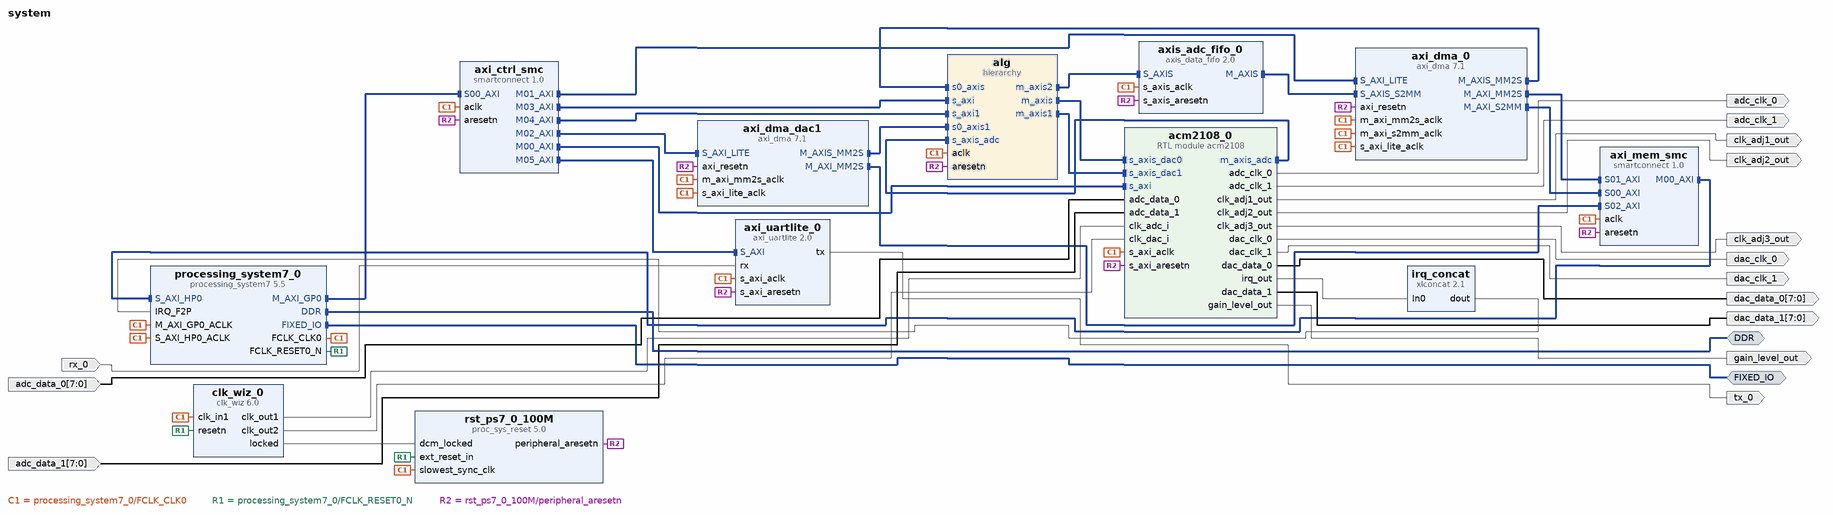
[diagram p0: block diagram of the top level]
# Vivado block design system, xc7z020clg400-1, Vivado 2025.1
create_bd_design system

create_bd_intf_port -mode Master -vlnv xilinx.com:interface:ddrx_rtl:1.0 DDR
create_bd_intf_port -mode Master -vlnv xilinx.com:display_processing_system7:fixedio_rtl:1.0 FIXED_IO
create_bd_port -dir O adc_clk_0
create_bd_port -dir I -from 7 -to 0 adc_data_0
create_bd_port -dir O adc_clk_1
create_bd_port -dir I -from 7 -to 0 adc_data_1
create_bd_port -dir O dac_clk_0
create_bd_port -dir O -from 7 -to 0 dac_data_0
create_bd_port -dir O dac_clk_1
create_bd_port -dir O -from 7 -to 0 dac_data_1
create_bd_port -dir O clk_adj1_out
create_bd_port -dir O clk_adj2_out
create_bd_port -dir O clk_adj3_out
create_bd_port -dir I rx_0
create_bd_port -dir O tx_0
create_bd_port -dir O gain_level_out

create_bd_cell -type ip -vlnv xilinx.com:ip:processing_system7:5.5 processing_system7_0
set_property -dict [list \
  CONFIG.PCW_APU_PERIPHERAL_FREQMHZ 666.666666 \
  CONFIG.PCW_ENET0_PERIPHERAL_ENABLE 0 \
  CONFIG.PCW_FPGA0_PERIPHERAL_FREQMHZ 50 \
  CONFIG.PCW_FPGA1_PERIPHERAL_FREQMHZ 50 \
  CONFIG.PCW_GPIO_MIO_GPIO_ENABLE 0 \
  CONFIG.PCW_IRQ_F2P_INTR 1 \
  CONFIG.PCW_PERIPHERAL_BOARD_PRESET None \
  CONFIG.PCW_PRESET_BANK1_VOLTAGE {LVCMOS 3.3V} \
  CONFIG.PCW_QSPI_PERIPHERAL_ENABLE 0 \
  CONFIG.PCW_SD0_GRP_CD_ENABLE 0 \
  CONFIG.PCW_SD0_GRP_WP_ENABLE 0 \
  CONFIG.PCW_SD0_PERIPHERAL_ENABLE 1 \
  CONFIG.PCW_SD0_SD0_IO {MIO 40 .. 45} \
  CONFIG.PCW_SDIO_PERIPHERAL_FREQMHZ 100 \
  CONFIG.PCW_UART1_PERIPHERAL_ENABLE 1 \
  CONFIG.PCW_UART1_UART1_IO {MIO 48 .. 49} \
  CONFIG.PCW_UART_PERIPHERAL_FREQMHZ 100 \
  CONFIG.PCW_UIPARAM_DDR_BUS_WIDTH {16 Bit} \
  CONFIG.PCW_UIPARAM_DDR_FREQ_MHZ 533.333333 \
  CONFIG.PCW_UIPARAM_DDR_PARTNO {MT41K256M16 RE-125} \
  CONFIG.PCW_USB0_PERIPHERAL_ENABLE 0 \
  CONFIG.PCW_USE_FABRIC_INTERRUPT 1 \
  CONFIG.PCW_USE_S_AXI_HP0 1 \
  CONFIG.preset None \
] [get_bd_cells processing_system7_0]
# 367 more settings of processing_system7_0 are not shown: defaults, MIO pin electricals, DDR timing, and values the tool derives
create_bd_cell -type ip -vlnv xilinx.com:ip:clk_wiz:6.0 clk_wiz_0
set_property -dict [list \
  CONFIG.CLKOUT1_REQUESTED_OUT_FREQ 35.000 \
  CONFIG.CLKOUT2_REQUESTED_OUT_FREQ 125.000 \
  CONFIG.CLKOUT2_USED true \
  CONFIG.NUM_OUT_CLKS 2 \
  CONFIG.PRIM_IN_FREQ 50.000 \
  CONFIG.PRIM_SOURCE No_buffer \
  CONFIG.RESET_TYPE ACTIVE_LOW \
  CONFIG.USE_RESET true \
] [get_bd_cells clk_wiz_0]
create_bd_cell -type ip -vlnv xilinx.com:ip:proc_sys_reset:5.0 rst_ps7_0_100M
create_bd_cell -type ip -vlnv xilinx.com:ip:smartconnect:1.0 axi_ctrl_smc
set_property -dict {CONFIG.NUM_CLKS 1 CONFIG.NUM_MI 6 CONFIG.NUM_SI 1} [get_bd_cells axi_ctrl_smc]
create_bd_cell -type ip -vlnv xilinx.com:ip:smartconnect:1.0 axi_mem_smc
set_property -dict {CONFIG.NUM_MI 1 CONFIG.NUM_SI 3} [get_bd_cells axi_mem_smc]
create_bd_cell -type ip -vlnv xilinx.com:ip:axi_dma:7.1 axi_dma_0
set_property -dict [list \
  CONFIG.c_include_mm2s 1 \
  CONFIG.c_include_s2mm 1 \
  CONFIG.c_include_sg 0 \
  CONFIG.c_s2mm_burst_size 16 \
  CONFIG.c_sg_length_width 23 \
] [get_bd_cells axi_dma_0]
create_bd_cell -type ip -vlnv xilinx.com:ip:axis_data_fifo:2.0 axis_adc_fifo_0
set_property -dict {CONFIG.FIFO_DEPTH 1024 CONFIG.HAS_TLAST 1 CONFIG.TDATA_NUM_BYTES 4} [get_bd_cells axis_adc_fifo_0]
create_bd_cell -type module -reference acm2108 acm2108_0
create_bd_cell -type ip -vlnv xilinx.com:ip:axi_dma:7.1 axi_dma_dac1
set_property -dict [list \
  CONFIG.c_include_mm2s 1 \
  CONFIG.c_include_s2mm 0 \
  CONFIG.c_include_sg 0 \
  CONFIG.c_mm2s_burst_size 16 \
  CONFIG.c_sg_length_width 23 \
] [get_bd_cells axi_dma_dac1]
create_bd_cell -type ip -vlnv xilinx.com:ip:xlconcat:2.1 irq_concat
set_property -dict {CONFIG.IN0_WIDTH 1 CONFIG.NUM_PORTS 1} [get_bd_cells irq_concat]
create_bd_cell -type hier alg
create_bd_cell -type ip -vlnv xilinx.com:ip:axi_uartlite:2.0 axi_uartlite_0
set_property -dict [list \
  CONFIG.C_BAUDRATE 115200 \
  CONFIG.C_DATA_BITS 8 \
  CONFIG.C_ODD_PARITY 0 \
  CONFIG.C_USE_PARITY 0 \
] [get_bd_cells axi_uartlite_0]

# ---- hierarchy /alg ----
current_bd_instance /alg
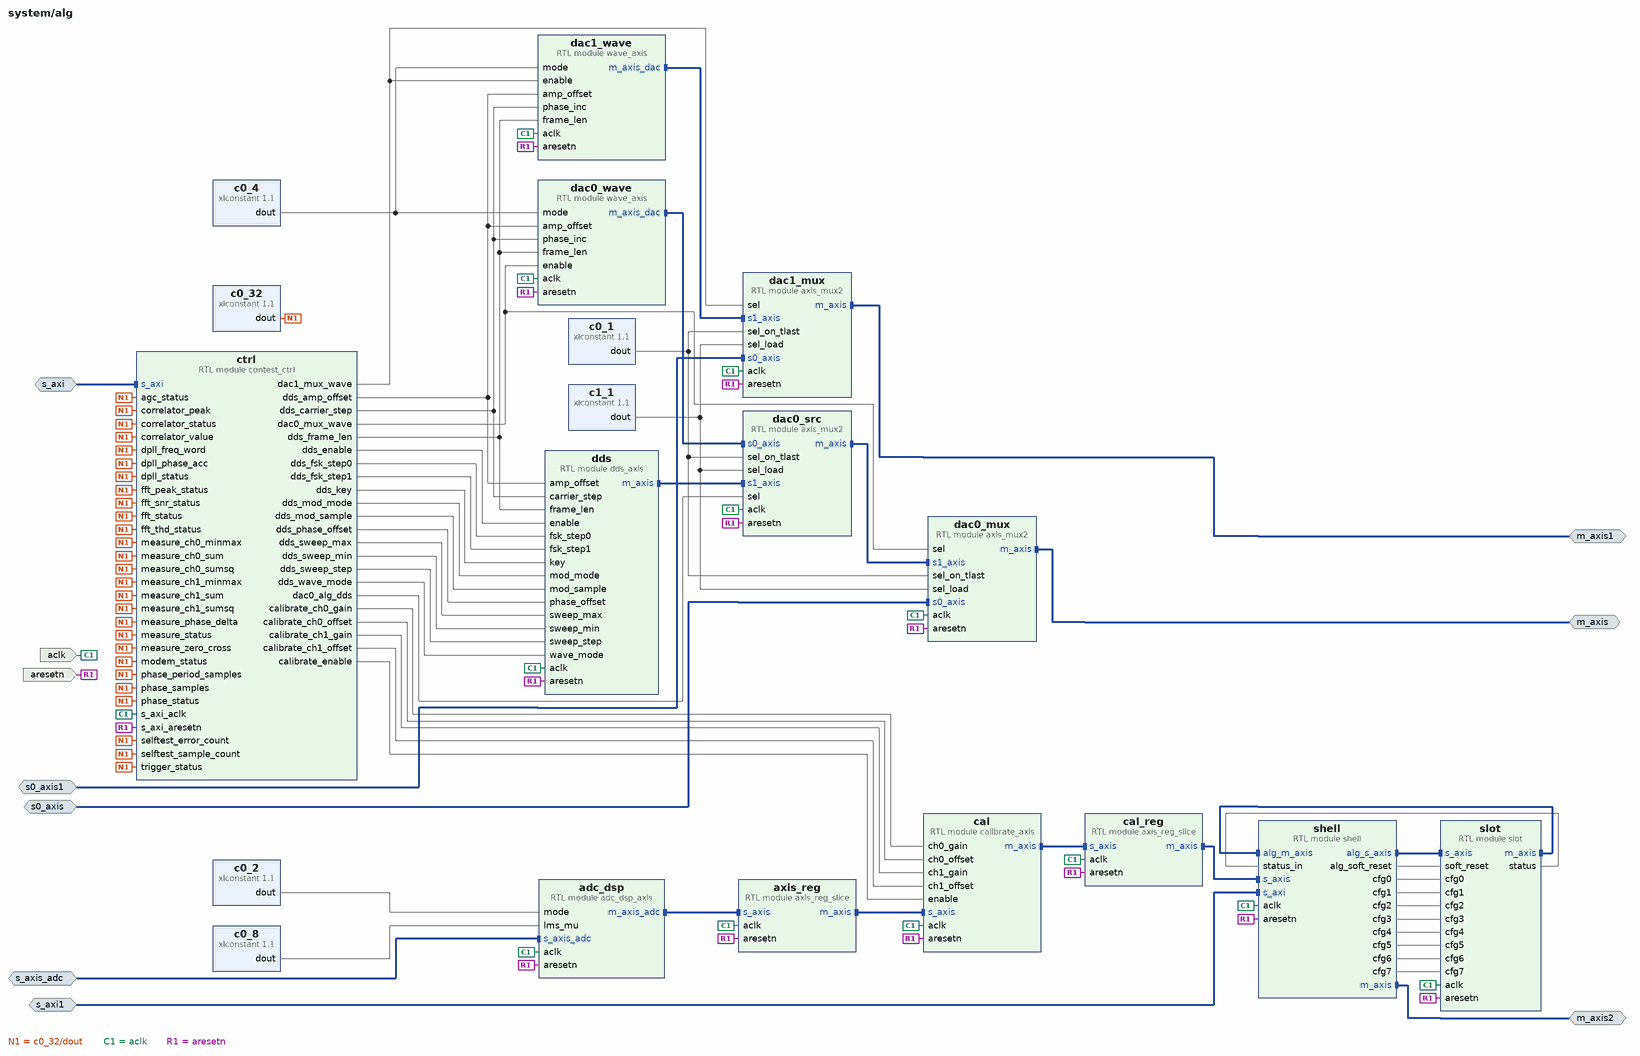
[diagram p1: block diagram inside /alg]
create_bd_intf_pin -mode Slave -vlnv xilinx.com:interface:aximm_rtl:1.0 s_axi
create_bd_intf_pin -mode Slave -vlnv xilinx.com:interface:axis_rtl:1.0 s_axis_adc
create_bd_intf_pin -mode Slave -vlnv xilinx.com:interface:axis_rtl:1.0 s0_axis
create_bd_intf_pin -mode Master -vlnv xilinx.com:interface:axis_rtl:1.0 m_axis
create_bd_intf_pin -mode Slave -vlnv xilinx.com:interface:axis_rtl:1.0 s0_axis1
create_bd_intf_pin -mode Master -vlnv xilinx.com:interface:axis_rtl:1.0 m_axis1
create_bd_intf_pin -mode Master -vlnv xilinx.com:interface:axis_rtl:1.0 m_axis2
create_bd_intf_pin -mode Slave -vlnv xilinx.com:interface:aximm_rtl:1.0 s_axi1
create_bd_pin -dir I -type clk aclk
create_bd_pin -dir I -type rst aresetn

create_bd_cell -type module -reference contest_ctrl ctrl
create_bd_cell -type module -reference adc_dsp_axis adc_dsp
create_bd_cell -type module -reference wave_axis dac0_wave
create_bd_cell -type module -reference wave_axis dac1_wave
create_bd_cell -type module -reference axis_mux2 dac0_mux
create_bd_cell -type module -reference axis_mux2 dac1_mux
create_bd_cell -type module -reference shell shell
create_bd_cell -type module -reference axis_reg_slice axis_reg
create_bd_cell -type module -reference axis_reg_slice cal_reg
create_bd_cell -type module -reference axis_mux2 dac0_src
create_bd_cell -type module -reference dds_axis dds
create_bd_cell -type module -reference calibrate_axis cal
create_bd_cell -type ip -vlnv xilinx.com:ip:xlconstant:1.1 c0_1
set_property -dict {CONFIG.CONST_VAL 0 CONFIG.CONST_WIDTH 1} [get_bd_cells c0_1]
create_bd_cell -type ip -vlnv xilinx.com:ip:xlconstant:1.1 c1_1
set_property -dict {CONFIG.CONST_VAL 1 CONFIG.CONST_WIDTH 1} [get_bd_cells c1_1]
create_bd_cell -type ip -vlnv xilinx.com:ip:xlconstant:1.1 c0_2
set_property -dict {CONFIG.CONST_VAL 0 CONFIG.CONST_WIDTH 2} [get_bd_cells c0_2]
create_bd_cell -type ip -vlnv xilinx.com:ip:xlconstant:1.1 c0_4
set_property -dict {CONFIG.CONST_VAL 0 CONFIG.CONST_WIDTH 4} [get_bd_cells c0_4]
create_bd_cell -type ip -vlnv xilinx.com:ip:xlconstant:1.1 c0_8
set_property -dict {CONFIG.CONST_VAL 0 CONFIG.CONST_WIDTH 8} [get_bd_cells c0_8]
create_bd_cell -type ip -vlnv xilinx.com:ip:xlconstant:1.1 c0_32
set_property -dict {CONFIG.CONST_VAL 0 CONFIG.CONST_WIDTH 32} [get_bd_cells c0_32]
create_bd_cell -type module -reference slot slot

# ---- connections ----

current_bd_instance /alg
connect_bd_intf_net -intf_net acm2108_0_m_axis_adc [get_bd_intf_pins s_axis_adc] [get_bd_intf_pins adc_dsp/s_axis_adc]
connect_bd_intf_net [get_bd_intf_pins adc_dsp/m_axis_adc] [get_bd_intf_pins axis_reg/s_axis]
connect_bd_intf_net -intf_net axi_ctrl_smc_M03_AXI [get_bd_intf_pins s_axi] [get_bd_intf_pins ctrl/s_axi]
connect_bd_intf_net -intf_net axi_ctrl_smc_M04_AXI [get_bd_intf_pins s_axi1] [get_bd_intf_pins shell/s_axi]
connect_bd_intf_net -intf_net axi_dma_0_M_AXIS_MM2S [get_bd_intf_pins s0_axis] [get_bd_intf_pins dac0_mux/s0_axis]
connect_bd_intf_net -intf_net axi_dma_dac1_M_AXIS_MM2S [get_bd_intf_pins s0_axis1] [get_bd_intf_pins dac1_mux/s0_axis]
connect_bd_intf_net [get_bd_intf_pins axis_reg/m_axis] [get_bd_intf_pins cal/s_axis]
connect_bd_intf_net [get_bd_intf_pins cal/m_axis] [get_bd_intf_pins cal_reg/s_axis]
connect_bd_intf_net [get_bd_intf_pins cal_reg/m_axis] [get_bd_intf_pins shell/s_axis]
connect_bd_intf_net [get_bd_intf_pins m_axis] [get_bd_intf_pins dac0_mux/m_axis]
connect_bd_intf_net [get_bd_intf_pins dac0_src/m_axis] [get_bd_intf_pins dac0_mux/s1_axis]
connect_bd_intf_net [get_bd_intf_pins dac0_wave/m_axis_dac] [get_bd_intf_pins dac0_src/s0_axis]
connect_bd_intf_net [get_bd_intf_pins m_axis1] [get_bd_intf_pins dac1_mux/m_axis]
connect_bd_intf_net [get_bd_intf_pins dac1_wave/m_axis_dac] [get_bd_intf_pins dac1_mux/s1_axis]
connect_bd_intf_net [get_bd_intf_pins dds/m_axis] [get_bd_intf_pins dac0_src/s1_axis]
connect_bd_intf_net [get_bd_intf_pins shell/alg_s_axis] [get_bd_intf_pins slot/s_axis]
connect_bd_intf_net [get_bd_intf_pins m_axis2] [get_bd_intf_pins shell/m_axis]
connect_bd_intf_net [get_bd_intf_pins slot/m_axis] [get_bd_intf_pins shell/alg_m_axis]
connect_bd_net [get_bd_pins c0_1/dout] [get_bd_pins dac0_mux/sel_on_tlast] [get_bd_pins dac1_mux/sel_on_tlast] [get_bd_pins dac0_src/sel_on_tlast]
connect_bd_net [get_bd_pins c0_2/dout] [get_bd_pins adc_dsp/mode]
connect_bd_net [get_bd_pins c0_32/dout] \
  [get_bd_pins ctrl/fft_status] [get_bd_pins ctrl/fft_peak_status] [get_bd_pins ctrl/fft_thd_status] \
  [get_bd_pins ctrl/fft_snr_status] [get_bd_pins ctrl/measure_status] [get_bd_pins ctrl/measure_ch0_minmax] \
  [get_bd_pins ctrl/measure_ch1_minmax] [get_bd_pins ctrl/measure_ch0_sum] [get_bd_pins ctrl/measure_ch1_sum] \
  [get_bd_pins ctrl/measure_ch0_sumsq] [get_bd_pins ctrl/measure_ch1_sumsq] [get_bd_pins ctrl/measure_zero_cross] \
  [get_bd_pins ctrl/measure_phase_delta] [get_bd_pins ctrl/trigger_status] [get_bd_pins ctrl/agc_status] \
  [get_bd_pins ctrl/phase_samples] [get_bd_pins ctrl/phase_period_samples] [get_bd_pins ctrl/phase_status] \
  [get_bd_pins ctrl/correlator_value] [get_bd_pins ctrl/correlator_peak] [get_bd_pins ctrl/correlator_status] \
  [get_bd_pins ctrl/dpll_phase_acc] [get_bd_pins ctrl/dpll_freq_word] [get_bd_pins ctrl/dpll_status] \
  [get_bd_pins ctrl/selftest_error_count] [get_bd_pins ctrl/selftest_sample_count] [get_bd_pins ctrl/modem_status]
connect_bd_net [get_bd_pins c0_4/dout] [get_bd_pins dac0_wave/mode] [get_bd_pins dac1_wave/mode]
connect_bd_net [get_bd_pins c0_8/dout] [get_bd_pins adc_dsp/lms_mu]
connect_bd_net [get_bd_pins c1_1/dout] [get_bd_pins dac0_mux/sel_load] [get_bd_pins dac1_mux/sel_load] [get_bd_pins dac0_src/sel_load]
connect_bd_net [get_bd_pins ctrl/calibrate_ch0_gain] [get_bd_pins cal/ch0_gain]
connect_bd_net [get_bd_pins ctrl/calibrate_ch0_offset] [get_bd_pins cal/ch0_offset]
connect_bd_net [get_bd_pins ctrl/calibrate_ch1_gain] [get_bd_pins cal/ch1_gain]
connect_bd_net [get_bd_pins ctrl/calibrate_ch1_offset] [get_bd_pins cal/ch1_offset]
connect_bd_net [get_bd_pins ctrl/calibrate_enable] [get_bd_pins cal/enable]
connect_bd_net [get_bd_pins ctrl/dac0_alg_dds] [get_bd_pins dac0_src/sel]
connect_bd_net [get_bd_pins ctrl/dac0_mux_wave] [get_bd_pins dac0_mux/sel] [get_bd_pins dac0_wave/enable]
connect_bd_net [get_bd_pins ctrl/dac1_mux_wave] [get_bd_pins dac1_mux/sel] [get_bd_pins dac1_wave/enable]
connect_bd_net [get_bd_pins ctrl/dds_amp_offset] [get_bd_pins dds/amp_offset] [get_bd_pins dac0_wave/amp_offset] [get_bd_pins dac1_wave/amp_offset]
connect_bd_net [get_bd_pins ctrl/dds_carrier_step] [get_bd_pins dds/carrier_step] [get_bd_pins dac0_wave/phase_inc] [get_bd_pins dac1_wave/phase_inc]
connect_bd_net [get_bd_pins ctrl/dds_enable] [get_bd_pins dds/enable]
connect_bd_net [get_bd_pins ctrl/dds_frame_len] [get_bd_pins dds/frame_len] [get_bd_pins dac0_wave/frame_len] [get_bd_pins dac1_wave/frame_len]
connect_bd_net [get_bd_pins ctrl/dds_fsk_step0] [get_bd_pins dds/fsk_step0]
connect_bd_net [get_bd_pins ctrl/dds_fsk_step1] [get_bd_pins dds/fsk_step1]
connect_bd_net [get_bd_pins ctrl/dds_key] [get_bd_pins dds/key]
connect_bd_net [get_bd_pins ctrl/dds_mod_mode] [get_bd_pins dds/mod_mode]
connect_bd_net [get_bd_pins ctrl/dds_mod_sample] [get_bd_pins dds/mod_sample]
connect_bd_net [get_bd_pins ctrl/dds_phase_offset] [get_bd_pins dds/phase_offset]
connect_bd_net [get_bd_pins ctrl/dds_sweep_max] [get_bd_pins dds/sweep_max]
connect_bd_net [get_bd_pins ctrl/dds_sweep_min] [get_bd_pins dds/sweep_min]
connect_bd_net [get_bd_pins ctrl/dds_sweep_step] [get_bd_pins dds/sweep_step]
connect_bd_net [get_bd_pins ctrl/dds_wave_mode] [get_bd_pins dds/wave_mode]
connect_bd_net -net processing_system7_0_FCLK_CLK0 [get_bd_pins aclk] \
  [get_bd_pins adc_dsp/aclk] [get_bd_pins dac0_mux/aclk] [get_bd_pins dac1_mux/aclk] [get_bd_pins shell/aclk] \
  [get_bd_pins axis_reg/aclk] [get_bd_pins cal_reg/aclk] [get_bd_pins dac0_src/aclk] [get_bd_pins dds/aclk] \
  [get_bd_pins cal/aclk] [get_bd_pins ctrl/s_axi_aclk] [get_bd_pins dac0_wave/aclk] [get_bd_pins dac1_wave/aclk] \
  [get_bd_pins slot/aclk]
connect_bd_net -net rst_ps7_0_100M_peripheral_aresetn [get_bd_pins aresetn] \
  [get_bd_pins adc_dsp/aresetn] [get_bd_pins dac0_mux/aresetn] [get_bd_pins dac1_mux/aresetn] [get_bd_pins shell/aresetn] \
  [get_bd_pins axis_reg/aresetn] [get_bd_pins cal_reg/aresetn] [get_bd_pins dac0_src/aresetn] [get_bd_pins dds/aresetn] \
  [get_bd_pins cal/aresetn] [get_bd_pins ctrl/s_axi_aresetn] [get_bd_pins dac0_wave/aresetn] [get_bd_pins dac1_wave/aresetn] \
  [get_bd_pins slot/aresetn]
connect_bd_net [get_bd_pins shell/alg_soft_reset] [get_bd_pins slot/soft_reset]
connect_bd_net [get_bd_pins shell/cfg0] [get_bd_pins slot/cfg0]
connect_bd_net [get_bd_pins shell/cfg1] [get_bd_pins slot/cfg1]
connect_bd_net [get_bd_pins shell/cfg2] [get_bd_pins slot/cfg2]
connect_bd_net [get_bd_pins shell/cfg3] [get_bd_pins slot/cfg3]
connect_bd_net [get_bd_pins shell/cfg4] [get_bd_pins slot/cfg4]
connect_bd_net [get_bd_pins shell/cfg5] [get_bd_pins slot/cfg5]
connect_bd_net [get_bd_pins shell/cfg6] [get_bd_pins slot/cfg6]
connect_bd_net [get_bd_pins shell/cfg7] [get_bd_pins slot/cfg7]
connect_bd_net [get_bd_pins slot/status] [get_bd_pins shell/status_in]

current_bd_instance /
connect_bd_intf_net [get_bd_intf_pins acm2108_0/m_axis_adc] [get_bd_intf_pins alg/s_axis_adc]
connect_bd_intf_net [get_bd_intf_pins axi_ctrl_smc/M00_AXI] [get_bd_intf_pins acm2108_0/s_axi]
connect_bd_intf_net [get_bd_intf_pins axi_ctrl_smc/M01_AXI] [get_bd_intf_pins axi_dma_0/S_AXI_LITE]
connect_bd_intf_net [get_bd_intf_pins axi_ctrl_smc/M02_AXI] [get_bd_intf_pins axi_dma_dac1/S_AXI_LITE]
connect_bd_intf_net [get_bd_intf_pins axi_ctrl_smc/M03_AXI] [get_bd_intf_pins alg/s_axi]
connect_bd_intf_net [get_bd_intf_pins axi_ctrl_smc/M04_AXI] [get_bd_intf_pins alg/s_axi1]
connect_bd_intf_net [get_bd_intf_pins axi_ctrl_smc/M05_AXI] [get_bd_intf_pins axi_uartlite_0/S_AXI]
connect_bd_intf_net [get_bd_intf_pins axi_dma_0/M_AXIS_MM2S] [get_bd_intf_pins alg/s0_axis]
connect_bd_intf_net [get_bd_intf_pins axi_dma_0/M_AXI_MM2S] [get_bd_intf_pins axi_mem_smc/S01_AXI]
connect_bd_intf_net [get_bd_intf_pins axi_dma_0/M_AXI_S2MM] [get_bd_intf_pins axi_mem_smc/S00_AXI]
connect_bd_intf_net [get_bd_intf_pins axi_dma_dac1/M_AXIS_MM2S] [get_bd_intf_pins alg/s0_axis1]
connect_bd_intf_net [get_bd_intf_pins axi_dma_dac1/M_AXI_MM2S] [get_bd_intf_pins axi_mem_smc/S02_AXI]
connect_bd_intf_net [get_bd_intf_pins axi_mem_smc/M00_AXI] [get_bd_intf_pins processing_system7_0/S_AXI_HP0]
connect_bd_intf_net [get_bd_intf_pins axis_adc_fifo_0/M_AXIS] [get_bd_intf_pins axi_dma_0/S_AXIS_S2MM]
connect_bd_intf_net -intf_net dac0_mux_m_axis [get_bd_intf_pins alg/m_axis] [get_bd_intf_pins acm2108_0/s_axis_dac0]
connect_bd_intf_net -intf_net dac1_mux_m_axis [get_bd_intf_pins alg/m_axis1] [get_bd_intf_pins acm2108_0/s_axis_dac1]
connect_bd_intf_net [get_bd_intf_ports DDR] [get_bd_intf_pins processing_system7_0/DDR]
connect_bd_intf_net [get_bd_intf_ports FIXED_IO] [get_bd_intf_pins processing_system7_0/FIXED_IO]
connect_bd_intf_net [get_bd_intf_pins processing_system7_0/M_AXI_GP0] [get_bd_intf_pins axi_ctrl_smc/S00_AXI]
connect_bd_intf_net -intf_net shell_m_axis [get_bd_intf_pins alg/m_axis2] [get_bd_intf_pins axis_adc_fifo_0/S_AXIS]
connect_bd_net [get_bd_pins acm2108_0/adc_clk_0] [get_bd_ports adc_clk_0]
connect_bd_net [get_bd_pins acm2108_0/adc_clk_1] [get_bd_ports adc_clk_1]
connect_bd_net [get_bd_pins acm2108_0/clk_adj1_out] [get_bd_ports clk_adj1_out]
connect_bd_net [get_bd_pins acm2108_0/clk_adj2_out] [get_bd_ports clk_adj2_out]
connect_bd_net [get_bd_pins acm2108_0/clk_adj3_out] [get_bd_ports clk_adj3_out]
connect_bd_net [get_bd_pins acm2108_0/dac_clk_0] [get_bd_ports dac_clk_0]
connect_bd_net [get_bd_pins acm2108_0/dac_clk_1] [get_bd_ports dac_clk_1]
connect_bd_net [get_bd_pins acm2108_0/dac_data_0] [get_bd_ports dac_data_0]
connect_bd_net [get_bd_pins acm2108_0/dac_data_1] [get_bd_ports dac_data_1]
connect_bd_net [get_bd_pins acm2108_0/gain_level_out] [get_bd_ports gain_level_out]
connect_bd_net [get_bd_pins acm2108_0/irq_out] [get_bd_pins irq_concat/In0]
connect_bd_net -net adc_data_0_0_1 [get_bd_ports adc_data_0] [get_bd_pins acm2108_0/adc_data_0]
connect_bd_net -net adc_data_1_0_1 [get_bd_ports adc_data_1] [get_bd_pins acm2108_0/adc_data_1]
connect_bd_net [get_bd_pins axi_uartlite_0/tx] [get_bd_ports tx_0]
connect_bd_net [get_bd_pins clk_wiz_0/clk_out1] [get_bd_pins acm2108_0/clk_adc_i]
connect_bd_net [get_bd_pins clk_wiz_0/clk_out2] [get_bd_pins acm2108_0/clk_dac_i]
connect_bd_net [get_bd_pins clk_wiz_0/locked] [get_bd_pins rst_ps7_0_100M/dcm_locked]
connect_bd_net [get_bd_pins irq_concat/dout] [get_bd_pins processing_system7_0/IRQ_F2P]
connect_bd_net [get_bd_pins processing_system7_0/FCLK_CLK0] \
  [get_bd_pins processing_system7_0/M_AXI_GP0_ACLK] [get_bd_pins processing_system7_0/S_AXI_HP0_ACLK] \
  [get_bd_pins clk_wiz_0/clk_in1] [get_bd_pins rst_ps7_0_100M/slowest_sync_clk] [get_bd_pins axi_ctrl_smc/aclk] \
  [get_bd_pins axi_mem_smc/aclk] [get_bd_pins axi_dma_0/s_axi_lite_aclk] [get_bd_pins axi_dma_0/m_axi_mm2s_aclk] \
  [get_bd_pins axi_dma_0/m_axi_s2mm_aclk] [get_bd_pins axis_adc_fifo_0/s_axis_aclk] \
  [get_bd_pins axi_dma_dac1/s_axi_lite_aclk] [get_bd_pins axi_dma_dac1/m_axi_mm2s_aclk] [get_bd_pins alg/aclk] \
  [get_bd_pins axi_uartlite_0/s_axi_aclk] [get_bd_pins acm2108_0/s_axi_aclk]
connect_bd_net [get_bd_pins processing_system7_0/FCLK_RESET0_N] [get_bd_pins clk_wiz_0/resetn] [get_bd_pins rst_ps7_0_100M/ext_reset_in]
connect_bd_net [get_bd_pins rst_ps7_0_100M/peripheral_aresetn] \
  [get_bd_pins axi_ctrl_smc/aresetn] [get_bd_pins axi_mem_smc/aresetn] [get_bd_pins axi_dma_0/axi_resetn] \
  [get_bd_pins axis_adc_fifo_0/s_axis_aresetn] [get_bd_pins axi_dma_dac1/axi_resetn] [get_bd_pins alg/aresetn] \
  [get_bd_pins axi_uartlite_0/s_axi_aresetn] [get_bd_pins acm2108_0/s_axi_aresetn]
connect_bd_net -net rx_0_1 [get_bd_ports rx_0] [get_bd_pins axi_uartlite_0/rx]

# ---- address map ----
assign_bd_address -offset 0x00000000 -range 512M -target_address_space [get_bd_addr_spaces axi_dma_0/Data_MM2S] [get_bd_addr_segs processing_system7_0/S_AXI_HP0/HP0_DDR_LOWOCM]
assign_bd_address -offset 0x00000000 -range 512M -target_address_space [get_bd_addr_spaces axi_dma_0/Data_S2MM] [get_bd_addr_segs processing_system7_0/S_AXI_HP0/HP0_DDR_LOWOCM]
assign_bd_address -offset 0x00000000 -range 512M -target_address_space [get_bd_addr_spaces axi_dma_dac1/Data_MM2S] [get_bd_addr_segs processing_system7_0/S_AXI_HP0/HP0_DDR_LOWOCM]
assign_bd_address -offset 0x40000000 -range 64K -target_address_space [get_bd_addr_spaces processing_system7_0/Data] [get_bd_addr_segs acm2108_0/s_axi/reg0]
assign_bd_address -offset 0x40010000 -range 64K -target_address_space [get_bd_addr_spaces processing_system7_0/Data] [get_bd_addr_segs alg/ctrl/s_axi/reg0]
assign_bd_address -offset 0x40030000 -range 64K -target_address_space [get_bd_addr_spaces processing_system7_0/Data] [get_bd_addr_segs alg/shell/s_axi/reg0]
assign_bd_address -offset 0x40400000 -range 64K -target_address_space [get_bd_addr_spaces processing_system7_0/Data] [get_bd_addr_segs axi_dma_0/S_AXI_LITE/Reg]
assign_bd_address -offset 0x40410000 -range 64K -target_address_space [get_bd_addr_spaces processing_system7_0/Data] [get_bd_addr_segs axi_dma_dac1/S_AXI_LITE/Reg]
assign_bd_address -offset 0x42C00000 -range 64K -target_address_space [get_bd_addr_spaces processing_system7_0/Data] [get_bd_addr_segs axi_uartlite_0/S_AXI/Reg]

validate_bd_design
save_bd_design
